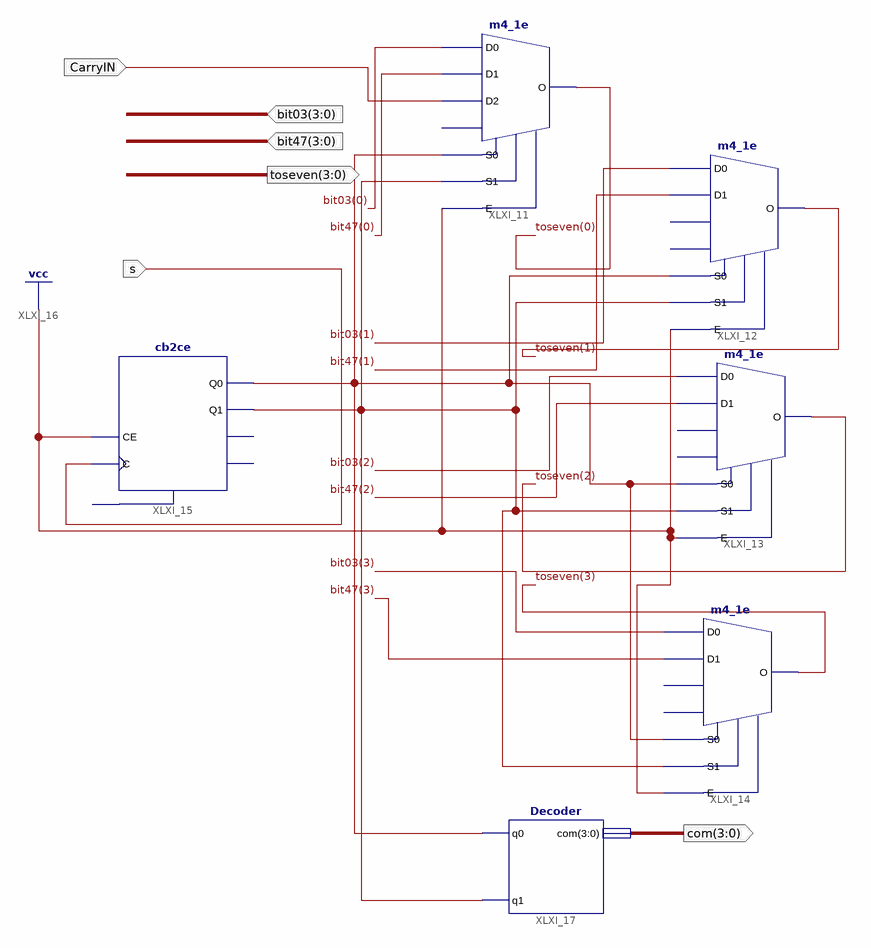
[diagram p0: schematic sheet 1]
// Xilinx ISE schematic Mymux3.sch (spartan6) as structural Verilog: 6 symbols, 6 ports
module Mymux3 (
  input  [3:0] bit03,
  input  [3:0] bit47,
  input  s,
  input  CarryIN,
  output [3:0] toseven,
  output [3:0] com
);

  wire XLXN_24, XLXN_28;

  m4_1e XLXI_11 (
    .D0(bit03[0]), .D1(bit47[0]), .D2(CarryIN), .E(1'b1), .S0(XLXN_28), .S1(XLXN_24), .O(toseven[0]));  // open: D3
  m4_1e XLXI_14 (.D0(bit03[3]), .D1(bit47[3]), .E(1'b1), .S0(XLXN_28), .S1(XLXN_24), .O(toseven[3]));  // open: D2, D3
  m4_1e XLXI_13 (.D0(bit03[2]), .D1(bit47[2]), .E(1'b1), .S0(XLXN_28), .S1(XLXN_24), .O(toseven[2]));  // open: D2, D3
  m4_1e XLXI_12 (.D0(bit03[1]), .D1(bit47[1]), .E(1'b1), .S0(XLXN_28), .S1(XLXN_24), .O(toseven[1]));  // open: D2, D3
  cb2ce XLXI_15 (.C(s), .CE(1'b1), .Q0(XLXN_28), .Q1(XLXN_24));  // open: CLR, CEO, TC
  Decoder XLXI_17 (.com(com), .q0(XLXN_28), .q1(XLXN_24));
endmodule
